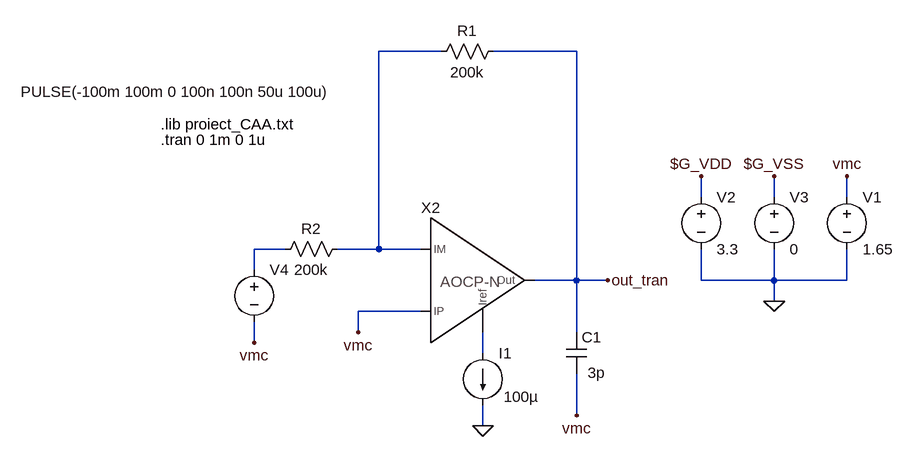
[diagram p0: schematic test_ao_cp_n_TRAN.asc]
test_ao_cp_n_TRAN.asc, the LTspice schematic file:
Version 4
SHEET 1 1600 816
WIRE 592 80 496 80
WIRE 800 80 672 80
WIRE 992 304 992 272
WIRE 1104 304 1104 272
WIRE 1216 304 1216 272
WIRE 352 384 304 384
WIRE 496 384 496 80
WIRE 496 384 432 384
WIRE 560 384 496 384
WIRE 304 416 304 384
WIRE 800 432 800 80
WIRE 800 432 736 432
WIRE 848 432 800 432
WIRE 992 432 992 384
WIRE 1104 432 1104 384
WIRE 1104 432 992 432
WIRE 1216 432 1216 384
WIRE 1216 432 1104 432
WIRE 1104 464 1104 432
WIRE 560 480 464 480
WIRE 464 512 464 480
WIRE 800 512 800 432
WIRE 304 528 304 496
WIRE 656 544 656 512
WIRE 800 640 800 576
WIRE 656 656 656 624
FLAG 1104 464 0
FLAG 992 272 $G_VDD
FLAG 1104 272 $G_VSS
FLAG 1216 272 vmc
FLAG 304 528 vmc
FLAG 848 432 out_tran
FLAG 464 512 vmc
FLAG 800 640 vmc
FLAG 656 656 0
SYMBOL voltage 992 288 R0
WINDOW 123 0 0 Left 2
WINDOW 39 0 0 Left 2
SYMATTR InstName V2
SYMATTR Value 3.3
SYMBOL voltage 1104 288 R0
WINDOW 123 0 0 Left 2
WINDOW 39 0 0 Left 2
SYMATTR InstName V3
SYMATTR Value 0
SYMBOL voltage 1216 288 R0
WINDOW 123 0 0 Left 2
WINDOW 39 0 0 Left 2
SYMATTR InstName V1
SYMATTR Value 1.65
SYMBOL res 688 64 R90
WINDOW 0 0 56 VBottom 2
WINDOW 3 32 56 VTop 2
SYMATTR InstName R1
SYMATTR Value 200k
SYMBOL current 656 544 R0
WINDOW 123 0 0 Left 2
WINDOW 39 0 0 Left 2
WINDOW 3 32 67 Left 2
SYMATTR Value 100µ
SYMATTR InstName I1
SYMBOL voltage 304 400 R0
WINDOW 3 -359 -258 Left 2
WINDOW 123 0 0 Left 2
WINDOW 39 0 0 Left 2
SYMATTR Value PULSE(-100m 100m 0 100n 100n 50u 100u)
SYMATTR InstName V4
SYMBOL res 448 368 R90
WINDOW 0 0 56 VBottom 2
WINDOW 3 32 56 VTop 2
SYMATTR InstName R2
SYMATTR Value 200k
SYMBOL cap 784 512 R0
WINDOW 3 33 62 Left 2
SYMATTR Value 3p
SYMATTR InstName C1
SYMBOL ao_cp_n 608 432 R0
SYMATTR InstName X2
TEXT 160 192 Left 2 !.lib proiect_CAA.txt
TEXT 160 216 Left 2 !.tran 0 1m 0 1u

The netlist it stands for:
* test_ao_cp_n_TRAN.asc
V2 $G_VDD 0 3.3
V3 $G_VSS 0 0
V1 vmc 0 1.65
R1 out_tran N001 200k
I1 N003 0 100µ
V4 N002 vmc PULSE(-100m 100m 0 100n 100n 50u 100u)
R2 N001 N002 200k
C1 out_tran vmc 3p
XX2 N001 vmc out_tran N003 ao_cp_n  ; pins IM IP Out Iref
.lib proiect_CAA.txt
.tran 0 1m 0 1u
.backanno
.end